# EAGLE design Motor15m_Transistor (EAGLE 9.6.2)
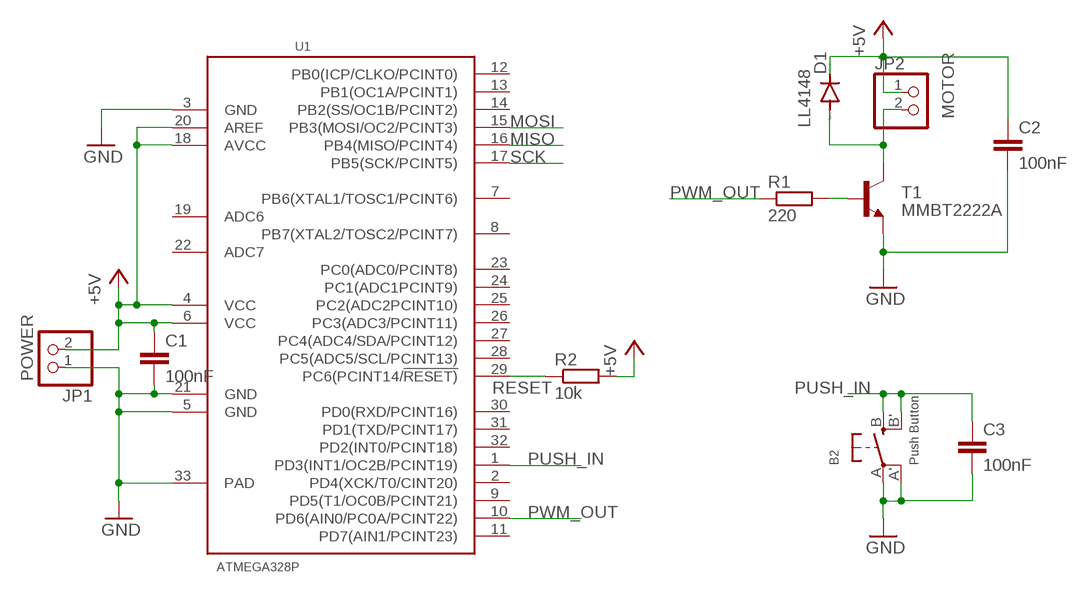
[diagram p0: schematic, sheet 1]

## Parts
B2  Push Button  SWITCH_TACT_SMT  [EVQ-Q2]
C1  100nF  C-EUC0805  [C0805]
C2  100nF  C-EUC0805  [C0805]
C3  100nF  C-EUC0805  [C0805]
D1  LL4148  DIODE-SOD80C  [SOD80C]
JP1  POWER  PINHD-1X2/90  [1X02/90]
JP2  MOTOR  PINHD-1X2/90  [1X02/90]
R1  220  R-EU_R0603  [R0603]
R2  10k  R-EU_R0603  [R0603]
T1  MMBT2222A  MMBT2222ALT1-NPN-SOT23-BEC  [SOT23-BEC]
U1  ATMEGA328P  MCU-ATMEGA328P-MU(QFN32)  [QFN32G-0.5-5X5MM]

## Nets
+5V: C1.1 C2.1 D1.C JP1.2 JP2.1 R2.2 U1.4(VCC) U1.6(VCC) U1.18(AVCC) U1.20(AREF)
GND: B2.A'(P1) B2.A(P) C1.2 C2.2 C3.2 JP1.1 T1.E U1.3(GND) U1.5(GND) U1.21(GND) U1.33(PAD)
MISO: U1.16(PB4(MISO/PCINT4))
MOSI: U1.15(PB3(MOSI/OC2/PCINT3))
N$1: R1.2 T1.B
N$2: D1.A JP2.2 T1.C
PUSH_IN: B2.B'(S1) B2.B(S) C3.1 U1.1(PD3(INT1/OC2B/PCINT19))
PWM_OUT: R1.1 U1.10(PD6(AIN0/PC0A/PCINT22))
RESET: R2.1 U1.29(PC6(PCINT14/!RESET))
SCK: U1.17(PB5(SCK/PCINT5))
Unconnected: U1.2(PD4(XCK/T0/CINT20)) U1.7(PB6(XTAL1/TOSC1/PCINT6)) U1.8(PB7(XTAL2/TOSC2/PCINT7)) U1.9(PD5(T1/OC0B/PCINT21)) U1.11(PD7(AIN1/PCINT23)) U1.12(PB0(ICP/CLKO/PCINT0)) U1.13(PB1(OC1A/PCINT1)) U1.14(PB2(SS/OC1B/PCINT2)) U1.19(ADC6) U1.22(ADC7) U1.23(PC0(ADC0/PCINT8)) U1.24(PC1(ADC1PCINT9)) U1.25(PC2(ADC2PCINT10)) U1.26(PC3(ADC3/PCINT11)) U1.27(PC4(ADC4/SDA/PCINT12)) U1.28(PC5(ADC5/SCL/PCINT13)) U1.30(PD0(RXD/PCINT16)) U1.31(PD1(TXD/PCINT17)) U1.32(PD2(INT0/PCINT18))

## Library data of the parts
B2 = microbuilder:SWITCH_TACT_SMT: SMT Tact Switches 6x6mm - Digikey: P12940SCT-ND KMR2 (4.6x2.8mm) - Digikey: 401-1426-1-ND EVQ-PQHB55 - Light Touch, 160GF (4.5x4.5mm) - Digikey: P8090SCT-ND
C1-C3 = rcl:C-EU: CAPACITOR, European symbol; SPICEPREFIX: C
D1 = diode:DIODE-: DIODE
JP1 JP2 = pinhead:PINHD-1X2: PIN HEADER
R1 R2 = rcl:R-EU_: RESISTOR, European symbol; SPICEPREFIX: R
T1 = transistor:*-NPN-: NPN Transistror BF959 corrected 2008.03.06
U1 = Seeed-IC:MCU-ATMEGA328P-MU(QFN32): 310010005; MPN: ATMEGA328P-MU; VALUE: ATMEGA328P-MU-QFN32

## Board
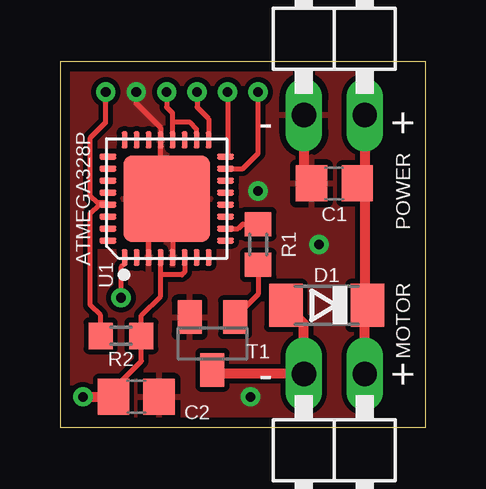
[diagram p1: board, top side]
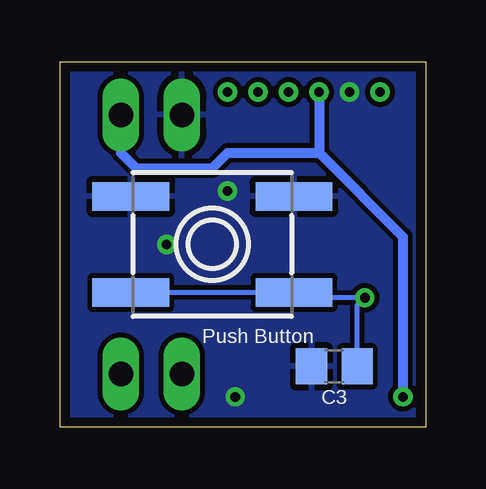
[diagram p2: board, bottom side, seen from below]

Size 15.24 x 15.24 mm. Coordinates in mm from the lower left corner, seen from the top.
Outline: 0,0 15.24,0 15.24,15.24 0,15.24 0,0
Copper layers (1*16): Top 0.035mm / dielectric 1.5mm / Bottom 0.035mm
Design rules "default8 *": minimum track width 8mil, minimum drill 0.4mm, track to track 8mil, track to pad 8mil, pad to pad 8mil, via to via 8mil, smd to smd 8mil, copper to edge 16mil, drill to drill 8mil, minimum pad ring 10mil, minimum via ring 8mil, stop-mask expansion 4mil, vias tented up to drill 0mil, thermal gap 10mil

### Footprints (pad centres in the part's own frame; a part is rotated, then mirrored left to right if it is on the bottom)
EVQ-Q2 = smd 3.2 x 1.2: A -3.4,-2; A' 3.4,-2; B -3.4,2; B' 3.4,2
C0805 = smd 1.3 x 1.5: 1 -0.95,0; 2 0.95,0
SOD80C = smd 1.4 x 1.8: A 1.7,0; C -1.7,0
1X02/90 = drill 1.016 long: 1 -1.27,-3.81; 2 1.27,-3.81
R0603 = smd 1 x 1.1: 1 -0.85,0; 2 0.85,0
SOT23-BEC = smd 1 x 1.4: B -0.95,-1.1; C 0,1.1; E 0.95,-1.1
QFN32G-0.5-5X5MM = smd 0.7 x 0.25: 1 -2.45,1.75; 2 -2.45,1.25; 3 -2.45,0.75; 4 -2.45,0.25; 5 -2.45,-0.25; 6 -2.45,-0.75; 7 -2.45,-1.25; 8 -2.45,-1.75; 17 2.45,-1.75; 18 2.45,-1.25; 19 2.45,-0.75; 20 2.45,-0.25; 21 2.45,0.25; 22 2.45,0.75; 23 2.45,1.25; 24 2.45,1.75 | smd 0.25 x 0.7: 9 -1.75,-2.45; 10 -1.25,-2.45; 11 -0.75,-2.45; 12 -0.25,-2.45; 13 0.25,-2.45; 14 0.75,-2.45; 15 1.25,-2.45; 16 1.75,-2.45; 25 1.75,2.45; 26 1.25,2.45; 27 0.75,2.45; 28 0.25,2.45; 29 -0.25,2.45; 30 -0.75,2.45; 31 -1.25,2.45; 32 -1.75,2.45 | smd 3.6 x 3.6: 33 0,0

### Placement (x,y rotation side)
B2  8.89,7.62 180 bottom
C1  11.43,10.16 180 top
C2  3.17,1.27 0 top
C3  3.81,2.54 180 bottom
D1  11.11,5.08 180 top
JP1  11.43,16.83 0 top
JP2  11.43,-1.59 180 top
R1  8.26,7.62 270 top
R2  2.54,3.81 0 top
T1  6.35,3.49 180 top
U1  4.45,9.53 90 top

### Tracks (layer width: path | path; a pad name or v marks a point on that pad's centre or on a via)
+5V  (via drill 0.4)
  Top 0.203: U1.20 4.7,12.7 | 4.7,12.7 4.7,13.09 4.45,13.34 v4.45,13.97 | 4.2,6.35 4.2,5.46 3.39,4.66 R2.2 3.39,2.75 2.23,1.59 C2.1 | 4.2,6.35 U1.4 | U1.6 5.2,6.46 5.08,6.35 4.2,6.35 | U1.18 5.7,12.43 5.42,12.7 4.7,12.7
  Top 0.406: JP1.2 12.7,10.48 C1.1 12.7,9.84 12.7,5.19 D1.C 12.7,4.97 JP2.1 | v0.95,1.27 C2.1
  Bottom 0.406: JP1.2 12.7,11.43 12.06,10.79 8.89,10.79 8.26,11.43 4.45,11.43 | v4.45,13.97 4.45,11.43 | v0.95,1.27 0.95,7.94 4.45,11.43
GND  (via drill 0.4)
  Top 0.203: U1.33 4.2,9.78 U1.21 4.2,12.47 3.17,13.49 v3.17,13.97 | U1.33 4.7,9.28 U1.5 | U1.3 3.69,8.78 U1.33
  Top 0.406: JP1.1 10.16,10.48 C1.2
  other vias: 7.94,1.27 10.79,7.62 8.26,9.84
  pour Top: 0,15.24 15.24,15.24 15.24,0 0,0
  pour Bottom: 0,15.24 15.24,15.24 15.24,0 0,0
MISO  (via drill 0.4)
  Top 0.203: v6.99,13.97 6.99,11.37 U1.16
MOSI  (via drill 0.4)
  Top 0.203: U1.15 7.62,10.78 8.26,11.41 v8.26,13.97
N$1
  Top 0.203: R1.2 8.26,5.55 T1.B
N$2
  Top 0.406: D1.A 10.16,4.33 JP2.2 6.52,2.22 T1.C
PUSH_IN  (via drill 0.4)
  Top 0.203: U1.1 2.69,6.82 2.54,6.67 v2.54,5.4
  Bottom 0.203: B2.B' B2.B 5.27,5.4 v2.54,5.4 2.86,5.08 C3.1
PWM_OUT
  Top 0.203: U1.10 7.42,8.28 7.62,8.47 R1.1
RESET  (via drill 0.4)
  Top 0.203: R2.1 1.69,4.66 1.27,5.08 1.27,8.92 1.63,9.28 U1.29 1.93,9.35 1.55,9.35 1.27,9.63 1.27,12.06 1.91,12.7 v1.91,13.97
SCK  (via drill 0.4)
  Top 0.203: v5.71,13.97 5.71,13.34 6.2,12.86 U1.17

### Text on the board
tPlace: - | + | - | +